# Altium schematic sheet Mechanical.SchDoc: Mechanical
size Letter; Date: 2017-02-19; Revision: A; SheetNumber: 6; SheetTotal: 6; ProjectTitle: CANwheel
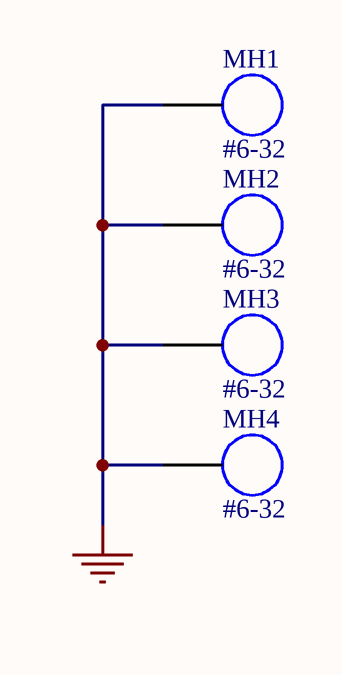
[diagram p0: Mechanical.SchDoc]

## Parts
MH1  #6-32  [MH-6-32]
MH2  #6-32  [MH-6-32]
MH3  #6-32  [MH-6-32]
MH4  #6-32  [MH-6-32]

## Nets
GND: MH1.1 MH2.1 MH3.1 MH4.1

## Notes on the sheet
- Date:
- Revision:
- Sheet:
- /

## Library data of the parts
MH1-MH4 = #6-32 Mounting Hole